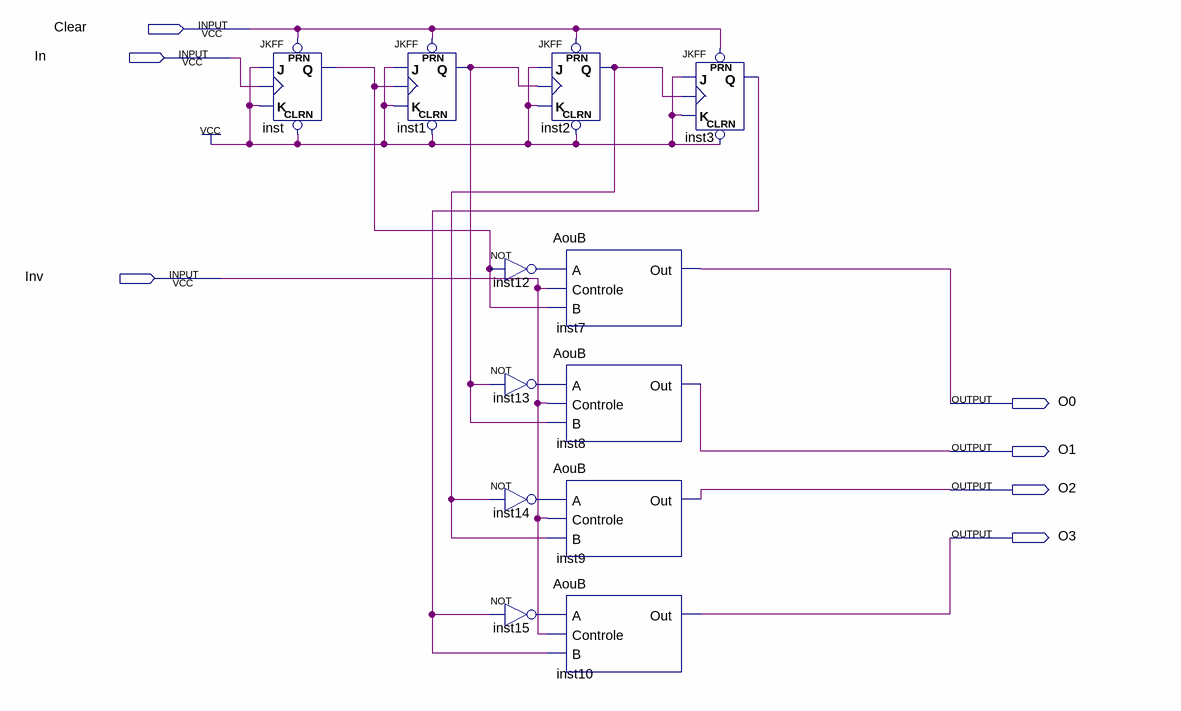
[diagram p0: schematic sheet]
// Quartus schematic Cont8jk.bdf as structural Verilog: 12 symbols, 7 pins
module Cont8jk (
  input  Clear,
  input  In,
  input  Inv,
  output O0,
  output O1,
  output O2,
  output O3
);

  wire inst1_q, inst2_q, inst3_q, inst12_out, inst13_out, inst14_out, inst15_out, inst_q;

  JKFF inst (.PRN(Clear), .CLRN(1'b1), .K(1'b1), .J(1'b1), .CLK(In), .Q(inst_q));
  JKFF inst1 (.PRN(Clear), .CLRN(1'b1), .K(1'b1), .J(1'b1), .CLK(inst_q), .Q(inst1_q));
  not inst12 (inst12_out, inst_q);
  not inst13 (inst13_out, inst1_q);
  not inst14 (inst14_out, inst2_q);
  not inst15 (inst15_out, inst3_q);
  JKFF inst2 (.PRN(Clear), .CLRN(1'b1), .K(1'b1), .J(1'b1), .CLK(inst1_q), .Q(inst2_q));
  AouB inst7 (.A(inst12_out), .Controle(Inv), .B(inst_q), .Out(O0));
  AouB inst8 (.A(inst13_out), .Controle(Inv), .B(inst1_q), .Out(O1));
  AouB inst9 (.A(inst14_out), .Controle(Inv), .B(inst2_q), .Out(O2));
  AouB inst10 (.A(inst15_out), .Controle(Inv), .B(inst3_q), .Out(O3));
  JKFF inst3 (.PRN(Clear), .CLRN(1'b1), .K(1'b1), .J(1'b1), .CLK(inst2_q), .Q(inst3_q));
endmodule
